# EAGLE schematic board_MCP73831_review_needed (EAGLE 9.4.2)
CNAME: Fume Extractor PCB; CREVISION: 1.0; DESIGNER: Kihun Song
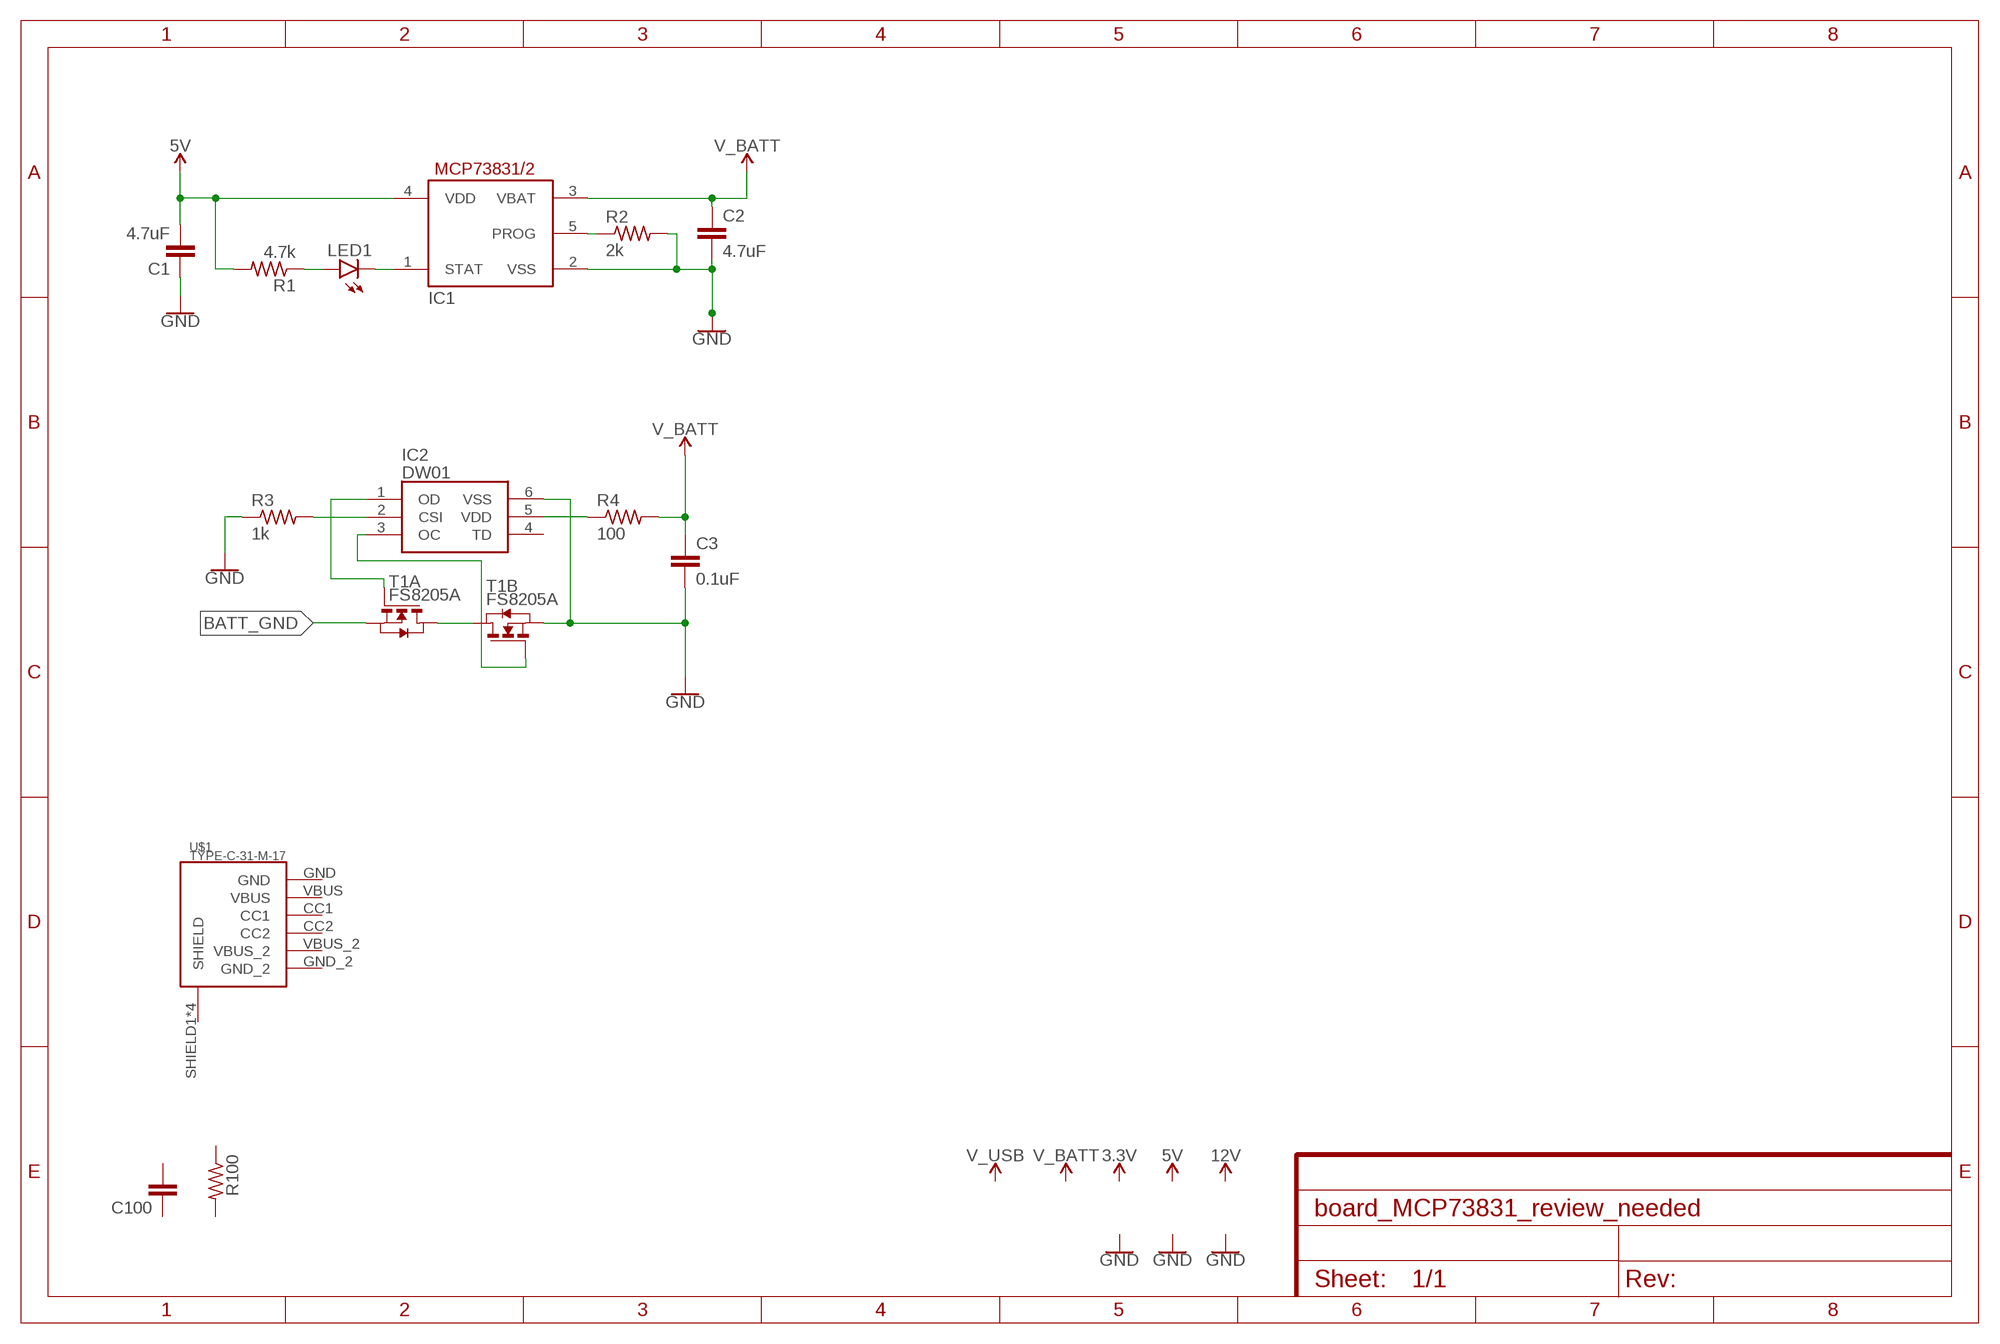
[diagram p0: schematic, sheet 1]

## Parts
C1  4.7uF  C-EUC0805  [C0805]
C2  4.7uF  C-EUC0805  [C0805]
C3  0.1uF  C-EUC0805  [C0805]
C100  C-EUC0805  [C0805]
IC1  MCP73831/OT  [SOT23-5L]
IC2  DW01  [SOT95P280X135-6N]
LED1  LEDCHIP-LED0805  [CHIP-LED0805]
R1  4.7k  R-US_R0805  [R0805]
R2  2k  R-US_R0805  [R0805]
R3  1k  R-US_R0805  [R0805]
R4  100  R-US_R0805  [R0805]
R100  R-US_R0805  [R0805]
T1  FS8205A  FS8205A-MOSFET  [TSSOP-8]
U$1  TYPE-C-31-M-17  [TYPE-C-31-M-17]

## Nets
5V [power]: C1.2 IC1.4(VDD) R1.2
BATT_GND [power]: T1.2(A:S) T1.3(A:S)
GND [power]: C1.1 C2.2 C3.2 IC1.2(VSS) IC2.6(VSS) R2.2 R3.1 T1.6(B:S) T1.7(B:S)
N$1: LED1.A R1.1
N$2: IC1.1(STAT) LED1.C
N$3: IC1.5(PROG) R2.1
N$4 [power]: T1.1(A:D) T1.8(B:D)
N$5: IC2.2(CSI) R3.2
N$6: IC2.1(OD) T1.4(A:G)
N$7: IC2.5(VDD) R4.1
N$10: IC2.3(OC) T1.5(B:G)
V_BATT [power]: C2.1 C3.1 IC1.3(VBAT) R4.2
Unconnected: C100.1 C100.2 IC2.4(TD) R100.1 R100.2 U$1.CC1 U$1.CC2 U$1.GND U$1.GND_2 U$1.SHIELD1(SHIELD) U$1.SHIELD2(SHIELD) U$1.SHIELD3(SHIELD) U$1.SHIELD4(SHIELD) U$1.VBUS U$1.VBUS_2

## Library data of the parts
C1-C3 C100 = rcl:C-EU: CAPACITOR, European symbol; SPICEPREFIX: C
IC1 = adafruit:MCP73831: MCP73831/2 Miniature Single-Cell, Fully Integrated Li-Ion, Li-Polymer Charge Management Controllers. Nice and small simple lipoly charge controller, with adjustable current and status output (LED) http://www.ladyada.net/library/pcb/eaglelibrary.html
IC2 = DW01:DW01: ic Source: Datasheet <https://datasheet.lcsc.com/szlcsc/1906271838_SLKORMICRO-Elec-DW01_C359989.pdf>; DESCRIPTION: ic; HEIGHT: 1.35mm; MANUFACTURER_NAME: Slkor; MANUFACTURER_PART_NUMBER: DW01
LED1 = led:LED: LED OSRAM: - CHIPLED LG R971, LG N971, LY N971, LG Q971, LY Q971, LO R971, LY R971 LH N974, LH R974 LS Q976, LO Q976, LY Q976 LO Q996 - Hyper CHIPLED LW Q18S LB Q993, LB Q99A, LB R99A - SideLED LS A670, LO A670, LY A670, LG A670, LP A670 LB A673, LV A673, LT A673, LW A673 LH A674 LY A675 LS A676, LA A676, LO A676, LY A676, LW A676 LS A679, LY A679, LG A679 - Hyper Micro SIDELED® LS Y876, LA Y876, LO Y876, LY Y876 LT Y87S - SmartLED LW L88C, LW L88S LB L89C, LB L89S, LG L890 LS L89K, LO L89K, LY L89K LS L896, LA L896, LO L896, LY L896 - TOPLED LS T670, LO T670, LY T670, LG T670, LP T670 LSG T670, LSP T670, LSY T670, LOP T670, LYG T670 LG T671, LOG T671, LSG T671 LB T673, LV T673, LT T673, LW T673 LH T674 LS T676, LA T676, LO T676, LY T676, LB T676, LH T676, LSB T676, LW T676 LB T67C, LV T67C, LT T67C, LS T67K, LO T67K, LY T67K, LW E67C LS E67B, LA E67B, LO E67B, LY E67B, LB E67C, LV E67C, LT E67C LW T67C LS T679, LY T679, LG T679 LS T770, LO T770, LY T770, LG T770, LP T770 LB T773, LV T773, LT T773, LW T773 LH T774 LS E675, LA E675, LY E675, LS T675 LS T776, LA T776, LO T776, LY T776, LB T776 LHGB T686 LT T68C, LB T68C - Hyper Mini TOPLED® LB M676 - Mini TOPLED Santana® LG M470 LS M47K, LO M47K, LY M47K Source: http://www.osram.convergy.de LUXEON: - LUMILED® LXK2-PW12-R00, LXK2-PW12-S00, LXK2-PW14-U00, LXK2-PW14-V00 LXK2-PM12-R00, LXK2-PM12-S00, LXK2-PM14-U00 LXK2-PE12-Q00, LXK2-PE12-R00, LXK2-PE12-S00, LXK2-PE14-T00, LXK2-PE14-U00 LXK2-PB12-K00, LXK2-PB12-L00, LXK2-PB12-M00, LXK2-PB14-N00, LXK2-PB14-P00, LXK2-PB14-Q00 LXK2-PR12-L00, LXK2-PR12-M00, LXK2-PR14-Q00, LXK2-PR14-R00 LXK2-PD12-Q00, LXK2-PD12-R00, LXK2-PD12-S00 LXK2-PH12-R00, LXK2-PH12-S00 LXK2-PL12-P00, LXK2-PL12-Q00, LXK2-PL12-R00 Source: www.luxeon.com KINGBRIGHT: KA-3528ASYC Source: www.kingbright.com
R1-R4 R100 = rcl:R-US_: RESISTOR, American symbol; SPICEPREFIX: R
T1 = FS8205A:FS8205A-MOSFET: DUAL N-CHANNEL ENHANCEMENT MODE MOSFET data sheet <http://goo.gl/dRgboR> Dave.Calaway Eagle Library <https://goo.gl/Muy1Tr>
U$1 = Type-C_Hroparts:TYPE-C-31-M-17

## Net classes
0 default: width 0.203 mm
1 power: width 0.61 mm